# Altium schematic sheet Узел UART преобразователя.SchDoc
size 420 x 297 mm; Address1: Address1; Address2: Address2; Address3: Address3; Address4: Address4; DocumentNumber: АБВГ.123456.001 Э3; SheetNumber: 1; Scale: 1:1; DocumentType: Схема электрическая принципиальная; FirstReferrence: АБВГ.123456.001
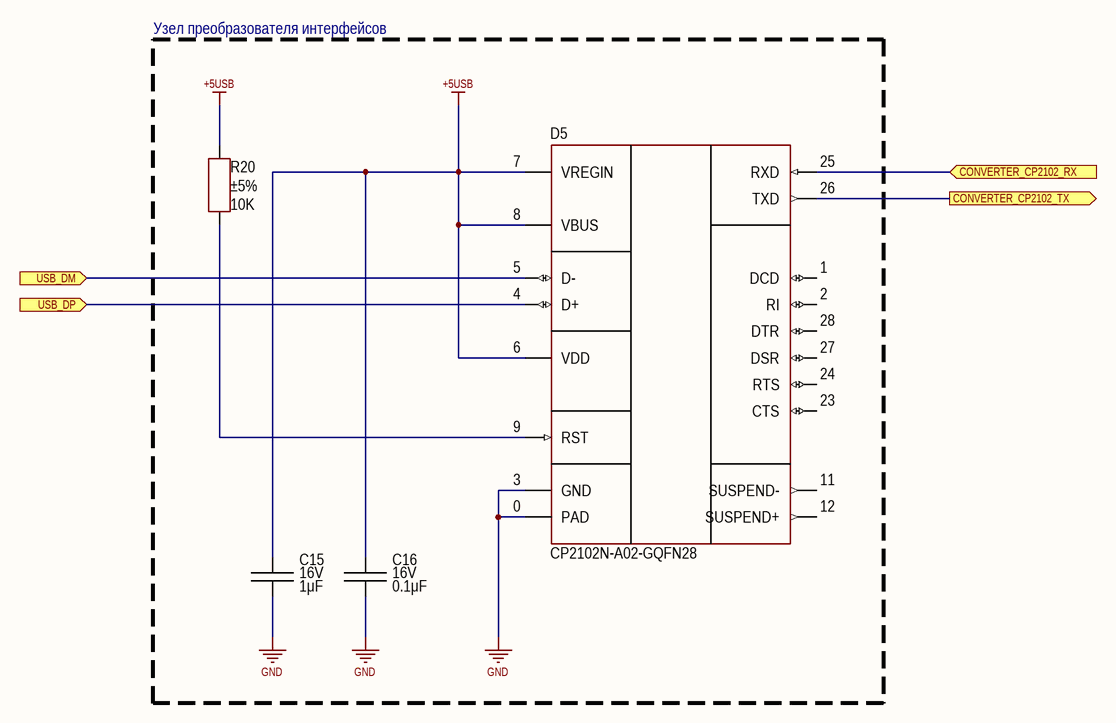
[diagram p0: Узел UART преобразователя.SchDoc]

## Parts
C15  value 1μF  Voltage: 16V  [CAP: 0603]
C16  value 0.1μF  Voltage: 16V  [CAP: 0603]
D5  PartNumber: CP2102N-A02-GQFN28  [28-QFN (5x5)]
R20  value 10K  Tolerance: ±5%  [RES: 0603]

## Blocks framed on the sheet
Узел преобразователя интерфейсов: C15 C16 D5 R20

## Ports
CONVERTER_CP2102_RX (in), CONVERTER_CP2102_TX (out), USB_DM (in), USB_DP (in)

## Nets
+5USB: C15.2 C16.2 D5.6(VDD) D5.7(VREGIN) D5.8(VBUS) R20.2
GND: C15.1 C16.1 D5.0(PAD) D5.3(GND)
CONVERTER_CP2102_RX: D5.25(RXD) ; port CONVERTER_CP2102_RX
CONVERTER_CP2102_TX: D5.26(TXD) ; port CONVERTER_CP2102_TX
USB_DM: D5.5(D-) ; port USB_DM
USB_DP: D5.4(D+) ; port USB_DP
NetD5_9: D5.9(RST) R20.1

Not connected (* = marked no-connect by the designer): D5 1(DCD) 2(RI) 11(SUSPEND-) 12(SUSPEND+) 23(CTS) 24(RTS) 27(DSR) 28(DTR)

## Notes on the sheet
- Перв. примен.
- Справ. №
- Подп. и дата
- Инв. № дубл.
- Взам. инв. №
- Разраб.
- Изм.
- Лист
- № докум.
- Подп.
- Дата
- Лит.
- Масса
- Масштаб
- Пров.
- Т.контр.
- Листов
- Инв. № подл.
- Утв.
- Н.контр.
- 2.106-A3
- Копировал
- Формат А3

## Library data of the parts
C15 = Ceramic_0603: Manufacturer: Yageo; PartNumber: CC0603KRX7R7BB104; ValueManufacturerPartNumber: Ceramic capacitor, 1μF, X7R, ±10%, 16V, 0603, -55...+125°C; TypeCapacitor: Ceramic capacitor; Tolerance: ±10%; TypeDielectric: X7R; Package: 0603; HelpURL: https://www.digikey.com/product-detail/en/yageo/CC0603KRX7R7BB104/311-1088-1-ND/302998; Temperature: -55...+125°C
C16 = Ceramic_0603: Manufacturer: Yageo; PartNumber: CC0603KRX7R7BB104; ValueManufacturerPartNumber: Ceramic capacitor, 0.1μF, X7R, ±10%, 16V, 0603, -55...+125°C; TypeCapacitor: Ceramic capacitor; Tolerance: ±10%; TypeDielectric: X7R; Package: 0603; HelpURL: https://www.digikey.com/product-detail/en/yageo/CC0603KRX7R7BB104/311-1088-1-ND/302998; Temperature: -55...+125°C
D5 = CP2102N: USB-to-UART; Manufacturer: Silicon Labs; ValueManufacturerPartNumber: IC usb-to-uart bridge, USB2.0, 3...3.6V, -40...+85°C, 28-VFQFN; Supply: 3...3.6V; HelpURL: https://www.digikey.com/product-detail/en/silicon-labs/CP2102N-A02-GQFN28/336-5889-ND/9863477; Package: 28-VFQFN; ComponentType: IC usb-to-uart bridge; Temperature: -40...+85°C; Standard: USB2.0
R20 = Resistor_0603: Manufacturer: Yageo; PartNumber: RC0603JR-07100RL; ValueManufacturerPartNumber: Resistor film, 10K, ±5%, 0603, 0.1W, -55...+125°C; TypeResistor: Resistor film; Power: 0.1W; Package: 0603; HelpURL: https://www.digikey.com/product-detail/en/yageo/RC0603JR-07100RL/311-100GRCT-ND/729644; Temperature: -55...+125°C